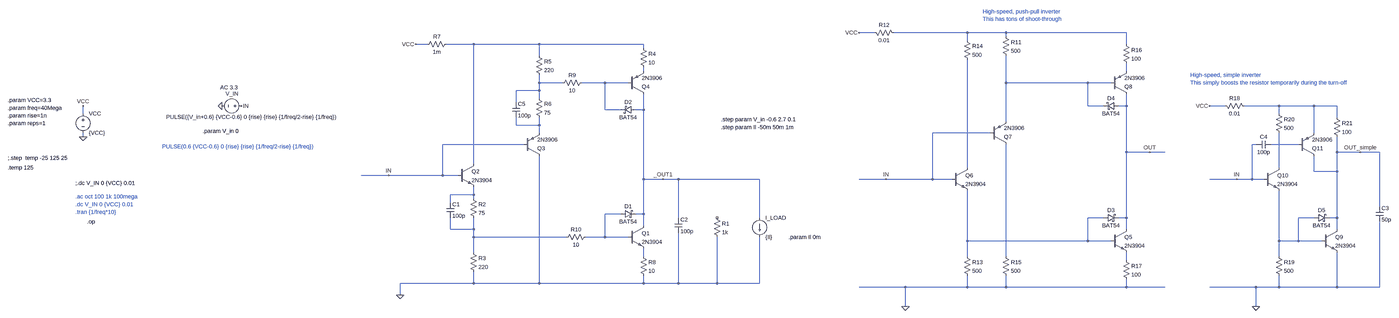
[diagram p0: schematic fast_inverter.asc, whole sheet]
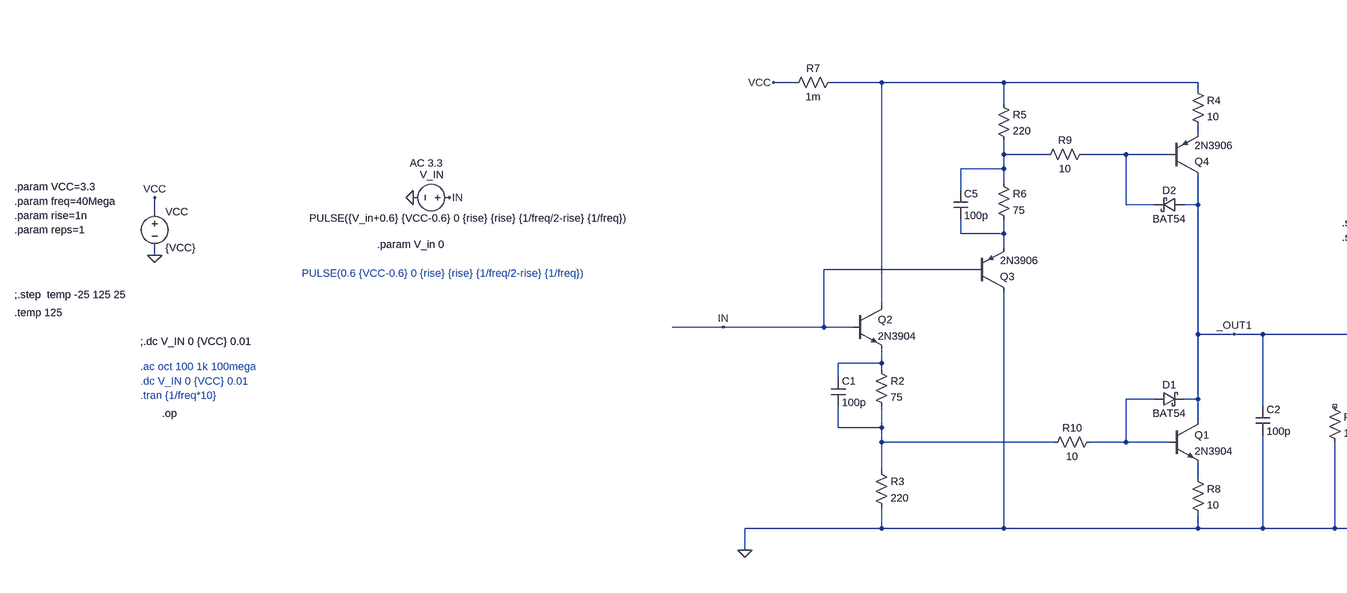
[diagram p1: schematic fast_inverter.asc, part, row 1 of 1, column 1 of 2]
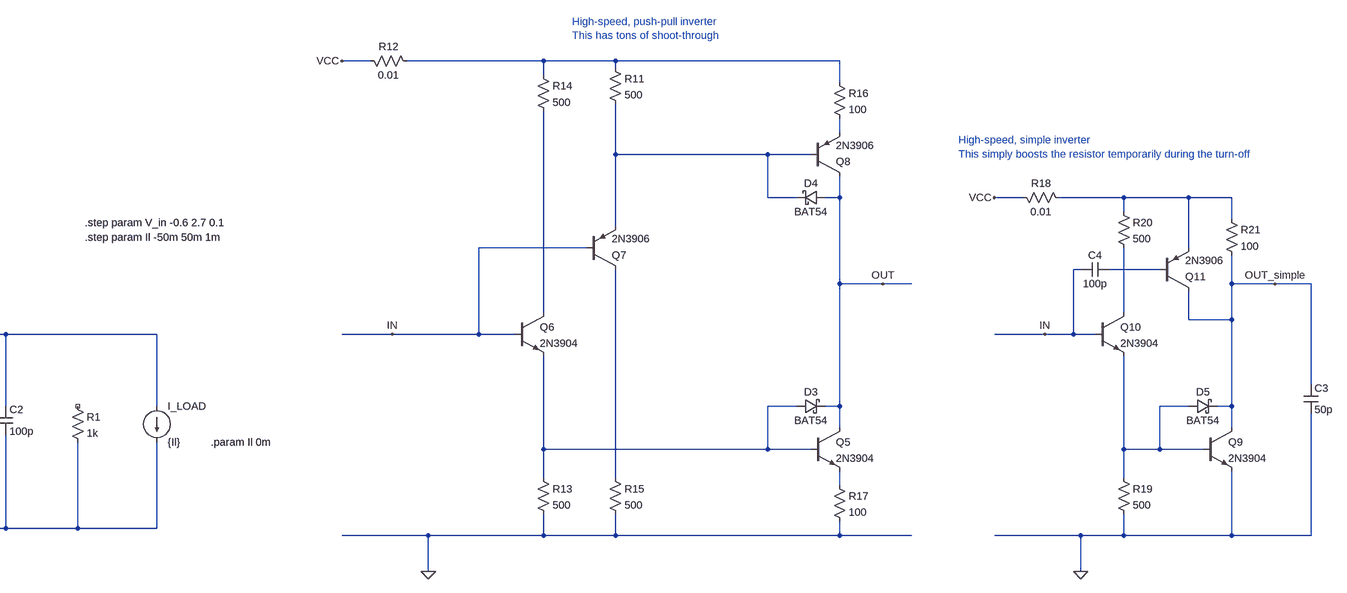
[diagram p2: schematic fast_inverter.asc, part, row 1 of 1, column 2 of 2]
fast_inverter.asc, the LTspice schematic file:
Version 4.1
SHEET 1 14868 10612
WIRE 3840 576 3776 576
WIRE 4224 576 3920 576
WIRE 4384 576 4224 576
WIRE 4896 576 4384 576
WIRE 4384 592 4384 576
WIRE 4224 608 4224 576
WIRE 1552 624 1504 624
WIRE 1744 624 1632 624
WIRE 2016 624 1744 624
WIRE 2448 624 2016 624
WIRE 4896 624 4896 576
WIRE 2448 640 2448 624
WIRE 2016 672 2016 624
WIRE 2448 736 2448 720
WIRE 4896 736 4896 704
WIRE 2016 784 2016 752
WIRE 2112 784 2016 784
WIRE 2288 784 2192 784
WIRE 2384 784 2288 784
WIRE 4384 784 4384 672
WIRE 4736 784 4384 784
WIRE 4832 784 4736 784
WIRE 2016 816 2016 784
WIRE 2016 816 1920 816
WIRE 2016 848 2016 816
WIRE 1920 864 1920 816
WIRE 4736 880 4736 784
WIRE 4800 880 4736 880
WIRE 4896 880 4896 832
WIRE 4896 880 4864 880
WIRE 6144 880 6080 880
WIRE 6368 880 6224 880
WIRE 6512 880 6368 880
WIRE 6608 880 6512 880
WIRE 2288 896 2288 784
WIRE 2352 896 2288 896
WIRE 2448 896 2448 832
WIRE 2448 896 2416 896
WIRE -752 912 -752 880
WIRE 6368 912 6368 880
WIRE 6608 928 6608 880
WIRE 4384 944 4384 784
WIRE 1920 960 1920 928
WIRE 2016 960 2016 928
WIRE 2016 960 1920 960
WIRE 2016 992 2016 960
WIRE 4320 992 4080 992
WIRE 6512 992 6512 880
WIRE -752 1008 -752 992
WIRE 1952 1040 1616 1040
WIRE 6272 1040 6256 1040
WIRE 6448 1040 6336 1040
WIRE 4896 1072 4896 880
WIRE 4992 1072 4896 1072
WIRE 5056 1072 4992 1072
WIRE 6608 1072 6608 1008
WIRE 6704 1072 6608 1072
WIRE 6784 1072 6704 1072
WIRE 1744 1120 1744 624
WIRE 4224 1136 4224 688
WIRE 6368 1136 6368 992
WIRE 6512 1152 6512 1088
WIRE 6608 1152 6608 1072
WIRE 6608 1152 6512 1152
WIRE 1392 1168 1200 1168
WIRE 1616 1168 1616 1040
WIRE 1616 1168 1392 1168
WIRE 1680 1168 1616 1168
WIRE 2448 1184 2448 896
WIRE 2528 1184 2448 1184
WIRE 2592 1184 2528 1184
WIRE 2928 1184 2592 1184
WIRE 3888 1184 3776 1184
WIRE 4080 1184 4080 992
WIRE 4080 1184 3888 1184
WIRE 4160 1184 4080 1184
WIRE 6192 1184 6080 1184
WIRE 6256 1184 6256 1040
WIRE 6256 1184 6192 1184
WIRE 6304 1184 6256 1184
WIRE 1744 1248 1744 1216
WIRE 1744 1248 1648 1248
WIRE 1744 1264 1744 1248
WIRE 1648 1280 1648 1248
WIRE 6784 1296 6784 1072
WIRE 2352 1328 2288 1328
WIRE 2448 1328 2448 1184
WIRE 2448 1328 2416 1328
WIRE 2592 1344 2592 1184
WIRE 2928 1344 2928 1184
WIRE 4800 1344 4736 1344
WIRE 4896 1344 4896 1072
WIRE 4896 1344 4864 1344
WIRE 6512 1344 6448 1344
WIRE 6608 1344 6608 1152
WIRE 6608 1344 6576 1344
WIRE 2448 1376 2448 1328
WIRE 1648 1392 1648 1344
WIRE 1744 1392 1744 1344
WIRE 1744 1392 1648 1392
WIRE 4896 1392 4896 1344
WIRE 6608 1392 6608 1344
WIRE 1744 1424 1744 1392
WIRE 2128 1424 1744 1424
WIRE 2288 1424 2288 1328
WIRE 2288 1424 2208 1424
WIRE 2384 1424 2288 1424
WIRE 4224 1440 4224 1232
WIRE 4736 1440 4736 1344
WIRE 4736 1440 4224 1440
WIRE 4832 1440 4736 1440
WIRE 6368 1440 6368 1232
WIRE 6448 1440 6448 1344
WIRE 6448 1440 6368 1440
WIRE 6544 1440 6448 1440
WIRE 1744 1488 1744 1424
WIRE 2448 1504 2448 1472
WIRE 4224 1504 4224 1440
WIRE 4384 1504 4384 1040
WIRE 6368 1504 6368 1440
WIRE 4896 1520 4896 1488
WIRE 1744 1616 1744 1568
WIRE 1744 1616 1440 1616
WIRE 2016 1616 2016 1088
WIRE 2016 1616 1744 1616
WIRE 2448 1616 2448 1584
WIRE 2448 1616 2016 1616
WIRE 2592 1616 2592 1408
WIRE 2592 1616 2448 1616
WIRE 2752 1616 2752 1424
WIRE 2752 1616 2592 1616
WIRE 2928 1616 2928 1424
WIRE 2928 1616 2752 1616
WIRE 3968 1632 3776 1632
WIRE 4224 1632 4224 1584
WIRE 4224 1632 3968 1632
WIRE 4384 1632 4384 1584
WIRE 4384 1632 4224 1632
WIRE 4896 1632 4896 1600
WIRE 4896 1632 4384 1632
WIRE 5056 1632 4896 1632
WIRE 6272 1632 6080 1632
WIRE 6368 1632 6368 1584
WIRE 6368 1632 6272 1632
WIRE 6608 1632 6608 1488
WIRE 6608 1632 6368 1632
WIRE 6784 1632 6784 1360
WIRE 6784 1632 6608 1632
WIRE 1440 1664 1440 1616
WIRE 3968 1712 3968 1632
WIRE 6272 1712 6272 1632
FLAG -752 1008 0
FLAG 128 880 IN
FLAG -752 880 VCC
FLAG 48 880 0
FLAG 1440 1664 0
FLAG 1504 624 VCC
FLAG 2528 1184 _OUT1
FLAG 1392 1168 IN
FLAG 4992 1072 OUT
FLAG 3888 1184 IN
FLAG 3776 576 VCC
FLAG 3968 1712 0
FLAG 6704 1072 OUT_simple
FLAG 6192 1184 IN
FLAG 6080 880 VCC
FLAG 6272 1712 0
SYMBOL voltage -752 896 R0
WINDOW 123 0 0 Left 0
WINDOW 39 0 0 Left 0
SYMATTR InstName VCC
SYMATTR Value {VCC}
SYMBOL voltage 144 880 R90
WINDOW 123 -77 30 VRight 2
WINDOW 39 0 0 Left 0
WINDOW 0 -51 28 VRight 2
WINDOW 3 46 -379 VRight 2
SYMATTR Value2 AC 3.3
SYMATTR InstName V_IN
SYMATTR Value PULSE({V_in+0.6} {VCC-0.6} 0 {rise} {rise} {1/freq/2-rise} {1/freq})
SYMBOL npn 2384 1376 R0
SYMATTR InstName Q1
SYMATTR Value 2N3904
SYMBOL schottky 2352 1344 R270
WINDOW 0 32 32 VTop 2
WINDOW 3 0 32 VBottom 2
SYMATTR InstName D1
SYMATTR Value BAT54
SYMATTR Description Diode
SYMATTR Type diode
SYMBOL npn 1680 1120 R0
SYMATTR InstName Q2
SYMATTR Value 2N3904
SYMBOL res 1728 1248 R0
SYMATTR InstName R2
SYMATTR Value 75
SYMBOL res 1728 1472 R0
SYMATTR InstName R3
SYMATTR Value 220
SYMBOL cap 1632 1280 R0
SYMATTR InstName C1
SYMATTR Value 100p
SYMBOL cap 2576 1344 R0
SYMATTR InstName C2
SYMATTR Value 100p
SYMBOL pnp 1952 1088 M180
SYMATTR InstName Q3
SYMATTR Value 2N3906
SYMBOL res 2000 656 R0
SYMATTR InstName R5
SYMATTR Value 220
SYMBOL res 2000 832 R0
SYMATTR InstName R6
SYMATTR Value 75
SYMBOL cap 1904 864 R0
SYMATTR InstName C5
SYMATTR Value 100p
SYMBOL schottky 2416 880 R90
WINDOW 0 0 32 VBottom 2
WINDOW 3 32 32 VTop 2
SYMATTR InstName D2
SYMATTR Value BAT54
SYMATTR Description Diode
SYMATTR Type diode
SYMBOL pnp 2384 832 M180
SYMATTR InstName Q4
SYMATTR Value 2N3906
SYMBOL res 1536 640 R270
WINDOW 0 32 56 VTop 2
WINDOW 3 0 56 VBottom 2
SYMATTR InstName R7
SYMATTR Value 1m
SYMBOL res 2736 1328 R0
SYMATTR InstName R1
SYMATTR Value 1k
SYMBOL current 2928 1344 R0
WINDOW 123 0 0 Left 0
WINDOW 39 0 0 Left 0
SYMATTR InstName I_LOAD
SYMATTR Value {Il}
SYMBOL res 2432 624 R0
SYMATTR InstName R4
SYMATTR Value 10
SYMBOL res 2432 1488 R0
SYMATTR InstName R8
SYMATTR Value 10
SYMBOL res 2208 768 R90
WINDOW 0 0 56 VBottom 2
WINDOW 3 32 56 VTop 2
SYMATTR InstName R9
SYMATTR Value 10
SYMBOL res 2224 1408 R90
WINDOW 0 0 56 VBottom 2
WINDOW 3 32 56 VTop 2
SYMATTR InstName R10
SYMATTR Value 10
SYMBOL npn 4832 1392 R0
SYMATTR InstName Q5
SYMATTR Value 2N3904
SYMBOL schottky 4800 1360 R270
WINDOW 0 32 32 VTop 2
WINDOW 3 0 32 VBottom 2
SYMATTR InstName D3
SYMATTR Value BAT54
SYMATTR Description Diode
SYMATTR Type diode
SYMBOL npn 4160 1136 R0
SYMATTR InstName Q6
SYMATTR Value 2N3904
SYMBOL pnp 4320 1040 M180
SYMATTR InstName Q7
SYMATTR Value 2N3906
SYMBOL res 4368 576 R0
SYMATTR InstName R11
SYMATTR Value 500
SYMBOL pnp 4832 832 M180
SYMATTR InstName Q8
SYMATTR Value 2N3906
SYMBOL schottky 4864 896 M270
WINDOW 0 32 32 VTop 2
WINDOW 3 0 32 VBottom 2
SYMATTR InstName D4
SYMATTR Value BAT54
SYMATTR Description Diode
SYMATTR Type diode
SYMBOL res 3824 560 M90
WINDOW 0 0 56 VBottom 2
WINDOW 3 32 56 VTop 2
SYMATTR InstName R12
SYMATTR Value 0.01
SYMBOL res 4208 1488 R0
SYMATTR InstName R13
SYMATTR Value 500
SYMBOL res 4208 592 R0
SYMATTR InstName R14
SYMATTR Value 500
SYMBOL res 4368 1488 R0
SYMATTR InstName R15
SYMATTR Value 500
SYMBOL res 4880 608 R0
SYMATTR InstName R16
SYMATTR Value 100
SYMBOL res 4880 1504 R0
SYMATTR InstName R17
SYMATTR Value 100
SYMBOL npn 6544 1392 R0
SYMATTR InstName Q9
SYMATTR Value 2N3904
SYMBOL schottky 6512 1360 R270
WINDOW 0 32 32 VTop 2
WINDOW 3 0 32 VBottom 2
SYMATTR InstName D5
SYMATTR Value BAT54
SYMATTR Description Diode
SYMATTR Type diode
SYMBOL npn 6304 1136 R0
SYMATTR InstName Q10
SYMATTR Value 2N3904
SYMBOL res 6128 864 M90
WINDOW 0 0 56 VBottom 2
WINDOW 3 32 56 VTop 2
SYMATTR InstName R18
SYMATTR Value 0.01
SYMBOL res 6352 1488 R0
SYMATTR InstName R19
SYMATTR Value 500
SYMBOL res 6352 896 R0
SYMATTR InstName R20
SYMATTR Value 500
SYMBOL res 6592 912 R0
SYMATTR InstName R21
SYMATTR Value 100
SYMBOL cap 6768 1296 R0
SYMATTR InstName C3
SYMATTR Value 50p
SYMBOL pnp 6448 1088 M180
SYMATTR InstName Q11
SYMATTR Value 2N3906
SYMBOL cap 6336 1024 R90
WINDOW 0 0 32 VBottom 2
WINDOW 3 32 32 VTop 2
SYMATTR InstName C4
SYMATTR Value 100p
TEXT -784 1200 Left 2 !;.dc V_IN 0 {VCC} 0.01
TEXT -784 1256 Left 2 ;.ac oct 100 1k 100mega
TEXT -784 1288 Left 2 ;.dc V_IN 0 {VCC} 0.01
TEXT -1064 856 Left 2 !.param VCC=3.3
TEXT -1064 888 Left 2 !.param freq=40Mega
TEXT -1064 920 Left 2 !.param rise=1n
TEXT -1064 952 Left 2 !.param reps=1
TEXT -1064 1096 Left 2 !;.step  temp -25 125 25
TEXT -1064 1136 Left 2 !.temp 125
TEXT -736 1360 Left 2 !.op
TEXT 2768 968 Left 2 !.step param Il -50m 50m 1m
TEXT -200 1048 Left 2 ;PULSE(0.6 {VCC-0.6} 0 {rise} {rise} {1/freq/2-rise} {1/freq})
TEXT 2768 936 Left 2 !.step param V_in -0.6 2.7 0.1
TEXT 3048 1424 Left 2 !.param Il 0m
TEXT -32 984 Left 2 !.param V_in 0
TEXT -784 1320 Left 2 ;.tran {1/freq*10}
TEXT 4288 488 Left 2 ;High-speed, push-pull inverter\nThis has tons of shoot-through
TEXT 6000 752 Left 2 ;High-speed, simple inverter\nThis simply boosts the resistor temporarily during the turn-off

The netlist it stands for:
* fast_inverter.asc
VCC VCC 0 {VCC}
V_IN IN 0 PULSE({V_in+0.6} {VCC-0.6} 0 {rise} {rise} {1/freq/2-rise} {1/freq}) AC 3.3
Q1 _OUT1 N014 N018 0 2N3904
D1 N014 _OUT1 BAT54
Q2 N002 IN N013 0 2N3904
R2 N013 N017 75
R3 N017 0 220
C1 N013 N017 100p
C2 _OUT1 0 100p
Q3 0 IN N009 0 2N3906
R5 N002 N005 220
R6 N005 N009 75
C5 N005 N009 100p
D2 _OUT1 N006 BAT54
Q4 _OUT1 N006 N003 0 2N3906
R7 VCC N002 1m
R1 NC_01 0 1k
I_LOAD _OUT1 0 {Il}
R4 N002 N003 10
R8 N018 0 10
R9 N006 N005 10
R10 N014 N017 10
Q5 OUT N015 N020 0 2N3904
D3 N015 OUT BAT54
Q6 N011 IN N015 0 2N3904
Q7 N019 IN N007 0 2N3906
R11 N001 N007 500
Q8 OUT N007 N004 0 2N3906
D4 OUT N007 BAT54
R12 VCC N001 0.01
R13 N015 0 500
R14 N001 N011 500
R15 N019 0 500
R16 N001 N004 100
R17 N020 0 100
Q9 OUT_simple N016 0 0 2N3904
D5 N016 OUT_simple BAT54
Q10 N012 IN N016 0 2N3904
R18 VCC N008 0.01
R19 N016 0 500
R20 N008 N012 500
R21 N008 OUT_simple 100
C3 OUT_simple 0 50p
Q11 OUT_simple N010 N008 0 2N3906
C4 N010 IN 100p
.model D D
.lib standard.dio
.model NPN NPN
.model PNP PNP
.lib standard.bjt
;.dc V_IN 0 {VCC} 0.01
* .ac oct 100 1k 100mega
* .dc V_IN 0 {VCC} 0.01
.param VCC=3.3
.param freq=40Mega
.param rise=1n
.param reps=1
;.step  temp -25 125 25
.temp 125
.op
.step param Il -50m 50m 1m
* PULSE(0.6 {VCC-0.6} 0 {rise} {rise} {1/freq/2-rise} {1/freq})
.step param V_in -0.6 2.7 0.1
.param Il 0m
.param V_in 0
* .tran {1/freq*10}
* High-speed, push-pull inverter
* This has tons of shoot-through
* High-speed, simple inverter
* This simply boosts the resistor temporarily during the turn-off
.backanno
.end